# Altium project AS5048A-breakout.PrjPcb
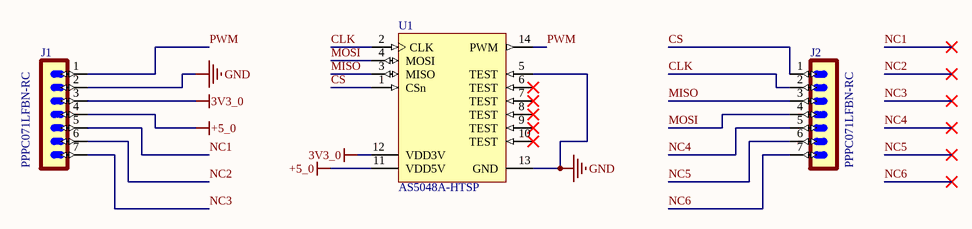
[diagram p0: AS5048A-Breakout.SchDoc]
1 sheet, 3 parts. Net scope: global (net labels, ports and power ports of the same name join across sheets).
Board file: AS5048A-breakout.PcbDoc

## Sheet AS5048A-Breakout.SchDoc
size A2; SheetNumber: 1; SheetTotal: 1

### Parts
J1  PPPC071LFBN-RC  [1X07-PIN]
J2  PPPC071LFBN-RC  [1X07-PIN]
U1  AS5048A-HTSP  [AMS-TSSOP-14-5000X4400DE_L]

### Nets
3V3_0: J1.3(P$3) U1.12(VDD3V)
+5_0: J1.4(P$4) U1.11(VDD5V)
GND: J1.2(P$2) U1.5(TEST) U1.13(GND)
CLK: J2.2(P$2) U1.2(CLK)
CS: J2.1(P$1) U1.1(CSn)
MISO: J2.3(P$3) U1.3(MISO)
MOSI: J2.4(P$4) U1.4(MOSI)
NC1: J1.5(P$5)
NC2: J1.6(P$6)
NC3: J1.7(P$7)
NC4: J2.5(P$5)
NC5: J2.6(P$6)
NC6: J2.7(P$7)
PWM: J1.1(P$1) U1.14(PWM)

Not connected (* = marked no-connect by the designer): U1 6(TEST)* 7(TEST)* 8(TEST)* 9(TEST)* 10(TEST)*

### Library data of the parts
J1 J2 = CMP-002-00071-1: 7 Position Header Connector 0.100 (2.54mm) Through Hole Gold; MF: Sullins Connector; Component Type: Standard; Availability: In Stock; Pins: 7; Purchase-URL: https://pricing.snapeda.com/search?q=PPPC071LFBN-RC&ref=eda; Source: PPPC071LFBN-RC.SchLib; MP: PPPC071LFBN-RC; Price: None; SnapEDA_Link: https://www.snapeda.com/parts/PPPC071LFBN-RC/Sullins+Connector+Solutions/view-part/?ref=snap; Case/Package: None; Value: *; Design Item ID: PPPC071LFBN-RC; Check_prices: https://www.snapeda.com/parts/PPPC071LFBN-RC/Sullins+Connector+Solutions/view-part/?ref=eda
U1 = CMP-0555-00034-2: Magnetic Rotary Encoder 14-bit Angular Position Sensor, 3.3 or 5 V, TSSOP-14, Pb-Free, Reel; Manufacturer: AMS; Supply Voltage (V): 3.3 or 5.0; Output: SPI, PWM; ComponentLink2URL: http://www.ams.com/eng/content/download/438523/1341157/143015; Mounting Technology: Surface Mount; PackageDescription: 14-Pin Small Outline Package, 5 x 4.4 mm Body, 0.65 mm Pitch; Resolution: 14-bit; ComponentLink1URL: www.ams.com; DatasheetVersion: Rev. 1.3; Features: SPI, PWM, In System Programmable; PartNumber: AS5048A-HTSP; Code_JEDEC: MO-153; PackageReference: TSSOP-14; PackageVersion: Rev. 2.7, 10/2010; ComponentLink1Description: Manufacturer URL; ComponentLink2Description: Datasheet